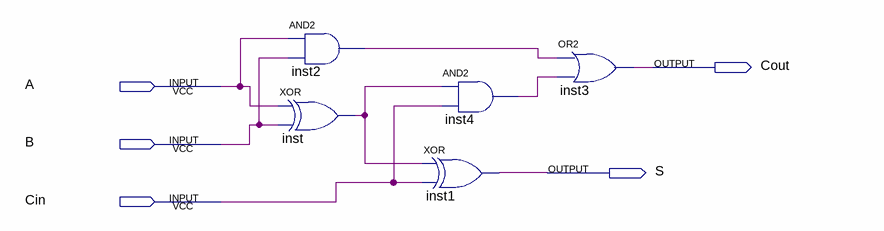
[diagram p0: schematic sheet]
// Quartus schematic somador_1bit.bdf as structural Verilog: 5 symbols, 5 pins
module somador_1bit (
  input  A,
  input  B,
  input  Cin,
  output Cout,
  output S
);

  wire inst2_out, inst4_out, inst_out;

  and inst2 (inst2_out, A, B);
  xor inst (inst_out, A, B);
  and inst4 (inst4_out, inst_out, Cin);
  xor inst1 (S, inst_out, Cin);
  or inst3 (Cout, inst2_out, inst4_out);
endmodule
